# EAGLE design Adaptor PCB (EAGLE 8.7.0)
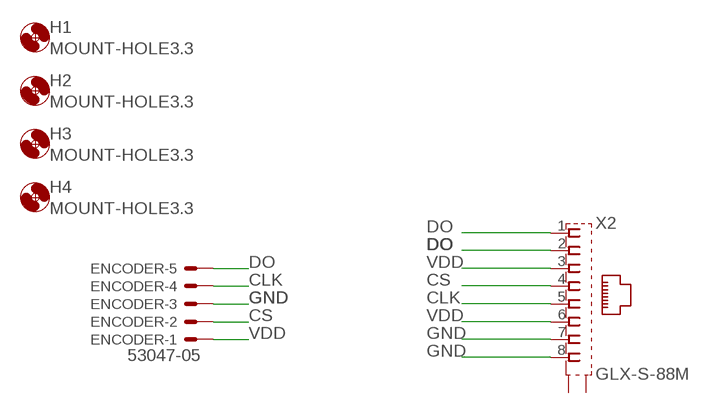
[diagram p0: schematic, sheet 1]

## Parts
ENCODER  53047-05  [53047-05]
H1  MOUNT-HOLE3.3  [3,3]
H2  MOUNT-HOLE3.3  [3,3]
H3  MOUNT-HOLE3.3  [3,3]
H4  MOUNT-HOLE3.3  [3,3]
X2  GLX-S-88M  [GLX-S-88M]

## Nets
CLK: ENCODER.4 X2.5
CS: ENCODER.2 X2.4
DO: ENCODER.5 X2.1 X2.2
GND: ENCODER.3 X2.7 X2.8
VDD: ENCODER.1 X2.3 X2.6
Unconnected: X2.S1 X2.S2

## Library data of the parts
ENCODER = con-molex:53?-05: CONNECTOR wire to board 1.25 mm (.049 inch) pitch header; MF: MOLEX; MPN: 53047-0510; OC_FARNELL: 9732861; OC_NEWARK: 38C9901
H1-H4 = holes:MOUNT-HOLE: MOUNTING HOLE with drill center marker
X2 = con-kycon:GLX-S-88M: Mod. Jack, Right Angle, 8 posiotion, 8 contatcs RJ45 Source: GLX-S-88M.pdf; OC_FARNELL: unknown; OC_NEWARK: unknown

## Board
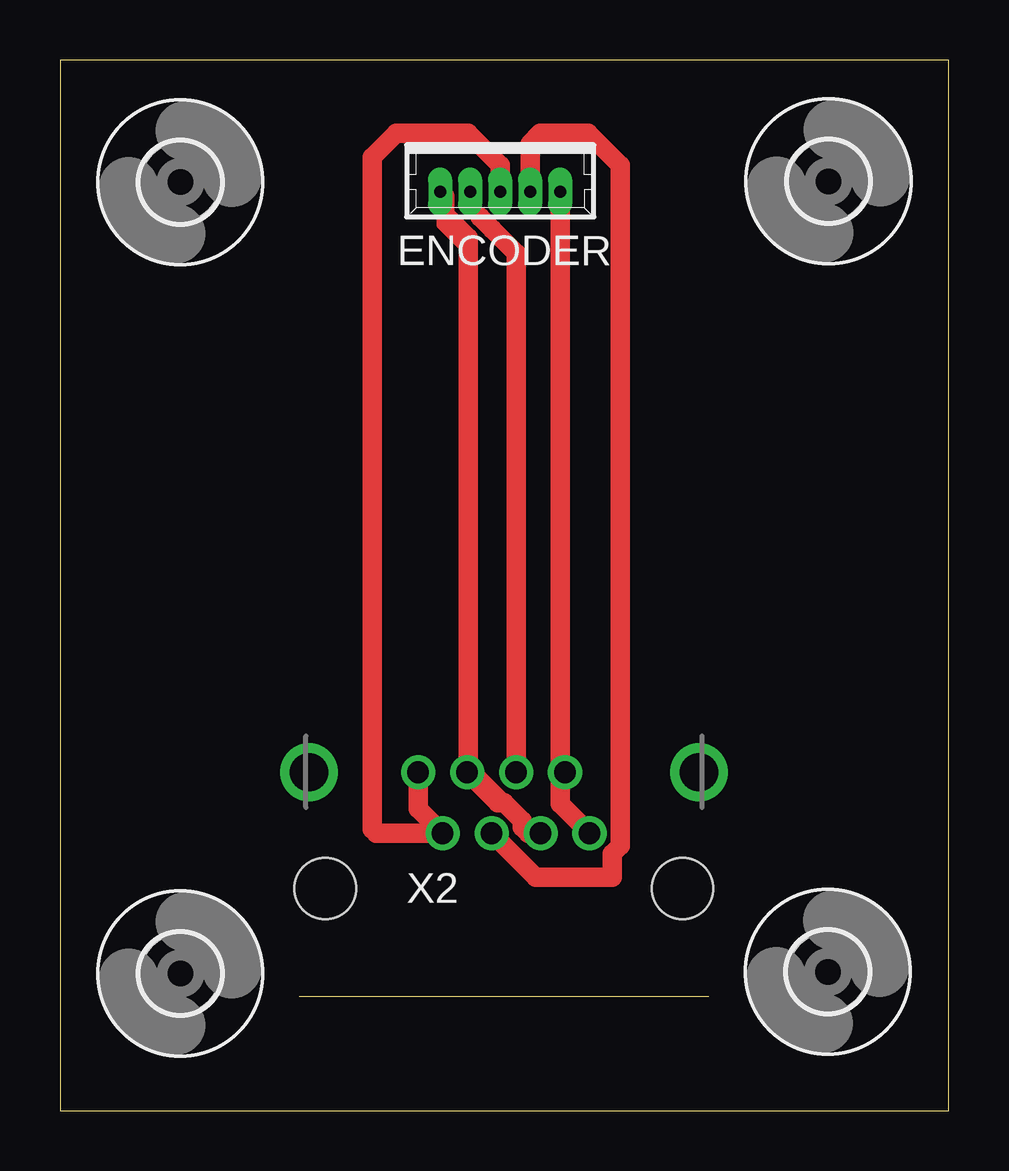
[diagram p1: board, top side]
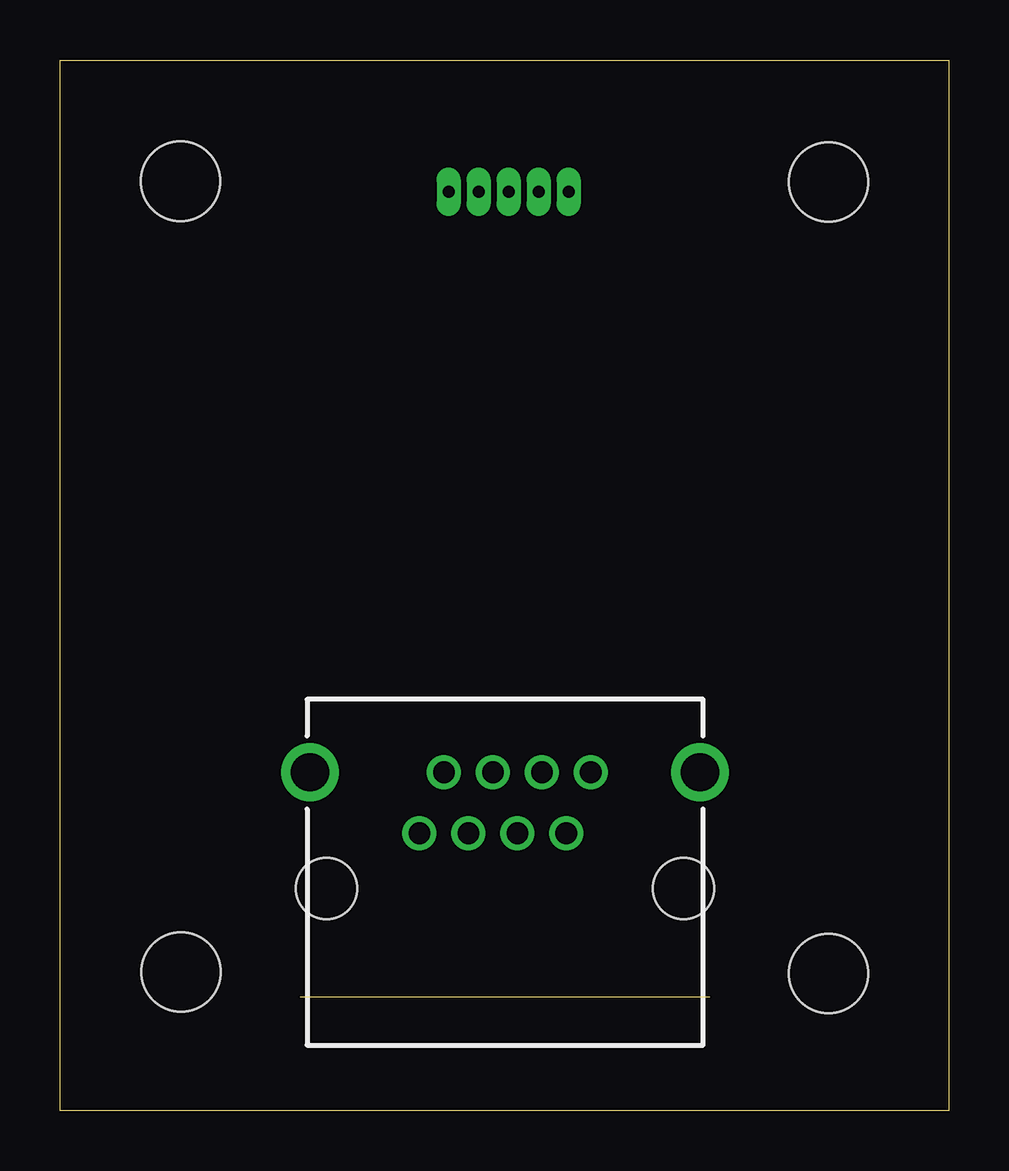
[diagram p2: board, bottom side, seen from below]

Size 37.04 x 43.79 mm. Coordinates in mm from the lower left corner, seen from the top.
Outline: 0,0 37.04,0 37.04,43.79 0,43.79 0,0
Copper layers (1*16): Top 0.035mm / dielectric 1.5mm / Bottom 0.035mm
Design rules "default": minimum track width 6mil, minimum drill 0.35mm, track to track 6mil, track to pad 6mil, pad to pad 6mil, via to via 6mil, smd to smd 6mil, copper to edge 40mil, drill to drill 6mil, minimum pad ring 10mil, minimum via ring 8mil, stop-mask expansion 4mil, vias tented up to drill 0mil, thermal gap 10mil

### Footprints (pad centres in the part's own frame; a part is rotated, then mirrored left to right if it is on the bottom)
53047-05 = drill 0.5 pad 0.698 long: 1 2.5,0.45; 2 1.25,0.45; 3 0,0.45; 4 -1.25,0.45; 5 -2.5,0.45
3,3 = hole 3.3: 0,0
GLX-S-88M = drill 0.9 pad 1.422: 1 -3.57,-2.3; 2 -2.55,-4.84; 3 -1.53,-2.3; 4 -0.51,-4.84; 5 0.51,-2.3; 6 1.53,-4.84; 7 2.55,-2.3; 8 3.57,-4.84 | drill 1.6 pad 2.184: S1 -8.125,-4.84; S2 8.125,-4.84 | hole 2.55: -7.44,0; 7.44,0

### Placement (x,y rotation side)
ENCODER  18.34,38.75 180 top
H1  32.02,38.74 0 top
H2  5.01,38.7 0 top
H3  31.99,5.8 0 top
H4  5.01,5.73 0 top
X2  18.49,9.27 180 top

### Tracks (layer width: path | path; a pad name or v marks a point on that pad's centre or on a via)
CLK
  Top 0.813: X2.5 19.82,9.73 23.01,9.73 23.01,10.72 23.33,11.04 23.33,39.41 22.01,40.73 20.01,40.73 19.59,40.31 ENCODER.4
CS
  Top 0.305: 17.51,37.23 17.01,37.73 17.01,38.22
  Top 0.813: X2.4 19,35.74 18.01,36.73 17.51,37.23 | ENCODER.2 17.01,38.22
DO
  Top 0.305: X2.1 21.04,12.59 X2.2 20.84,14.31 ENCODER.5
  Top 0.813: X2.1 20.84,12.79 ENCODER.5
GND
  Top 0.305: 14.92,12.59 15.9,11.62 X2.7 13.17,11.57 13.01,11.73 | 18.34,38.73 ENCODER.3
  Top 0.813: 18.34,38.73 18.34,39.4 17.01,40.73 14.01,40.73 13.01,39.73 13.01,11.73 | 13.17,11.57 15.85,11.57 15.9,11.62 | X2.7 14.92,12.59 X2.8
VDD
  Top 0.305: ENCODER.1 15.84,36.9 16.96,35.78 X2.6 17.01,14.11 17.48,14.11 X2.3
  Top 0.813: ENCODER.1 16.03,38.11 16.03,37.36 17.01,36.37 17.01,14.11 | X2.3 19.5,11.57 19.25,11.82 19.25,12.1 18.51,12.84 18.23,12.84 X2.6

### Text on the board
tValues: Encoder Interface | SNEPO 2018 | VDD 6,3 / CS 4 / VSS 7,8 / CLK 5 / DO 1,2